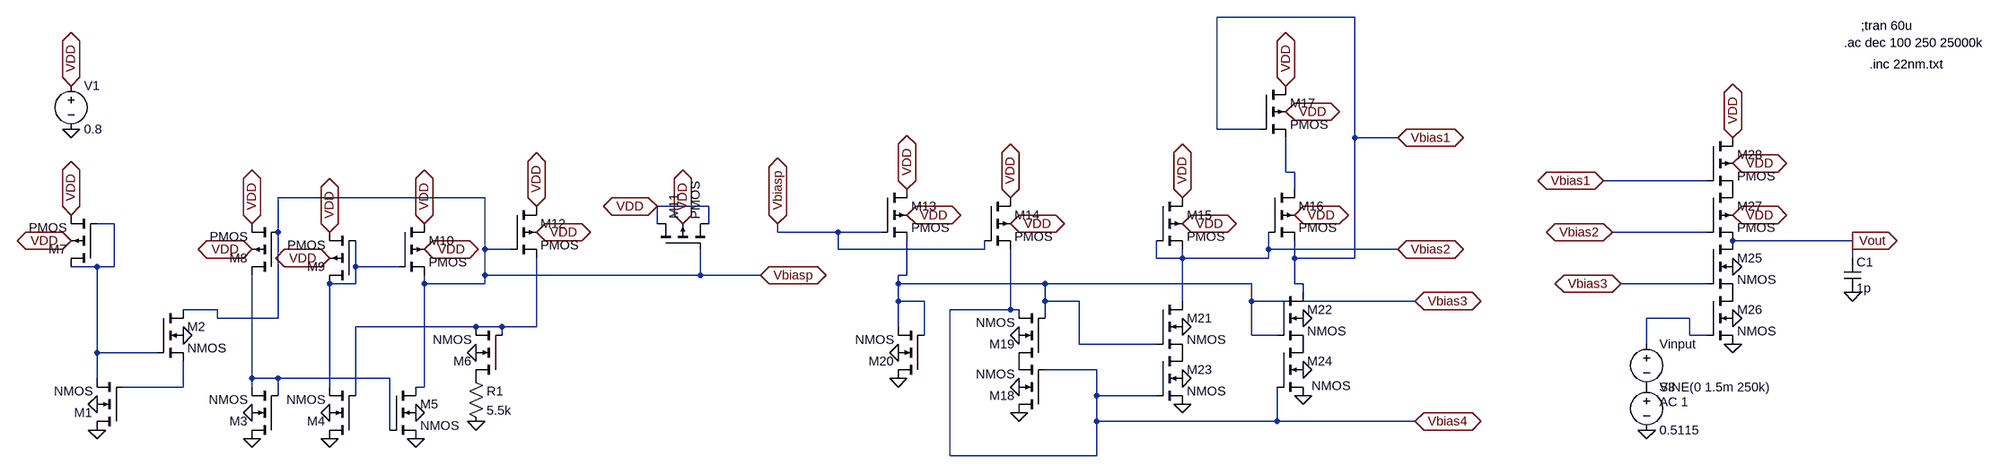
[diagram p0: schematic ckt_with_22nm.asc]
ckt_with_22nm.asc, the LTspice schematic file:
Version 4
SHEET 1 3784 680
WIRE 2416 -496 2160 -496
WIRE 2160 -288 2160 -496
WIRE 2240 -288 2160 -288
WIRE 2416 -272 2416 -496
WIRE 2496 -272 2416 -272
WIRE 2288 -208 2288 -272
WIRE 2304 -208 2288 -208
WIRE 3200 -192 3008 -192
WIRE 2304 -176 2304 -208
WIRE 784 -160 400 -160
WIRE 1200 -144 1104 -144
WIRE 96 -112 64 -112
WIRE 1104 -112 1104 -144
WIRE 1200 -112 1200 -144
WIRE 400 -96 400 -160
WIRE 1328 -96 1328 -112
WIRE 1440 -96 1328 -96
WIRE 1520 -96 1440 -96
WIRE 3200 -96 3024 -96
WIRE 3520 -80 3248 -80
WIRE 784 -64 784 -160
WIRE 832 -64 784 -64
WIRE 1440 -64 1440 -96
WIRE 1712 -64 1712 -80
WIRE 1712 -64 1440 -64
WIRE 2256 -64 2256 -96
WIRE 2496 -64 2256 -64
WIRE 2048 -48 2048 -80
WIRE 2096 -48 2096 -64
WIRE 2096 -48 2048 -48
WIRE 2256 -48 2256 -64
WIRE 2256 -48 2096 -48
WIRE 2304 -48 2304 -80
WIRE 2416 -48 2416 -272
WIRE 2416 -48 2304 -48
WIRE 3520 -48 3520 -80
WIRE 64 -32 16 -32
WIRE 96 -32 96 -112
WIRE 96 -32 64 -32
WIRE 544 -32 544 -80
WIRE 624 -32 544 -32
WIRE 784 -16 784 -64
WIRE 1184 -16 1184 -64
WIRE 1184 -16 784 -16
WIRE 1296 -16 1184 -16
WIRE 1568 -16 1568 -80
WIRE 1568 -16 1552 -16
WIRE 544 0 544 -32
WIRE 544 0 496 0
WIRE 672 0 672 -16
WIRE 784 0 784 -16
WIRE 784 0 672 0
WIRE 1552 0 1552 -16
WIRE 1824 0 1552 0
WIRE 2224 0 1824 0
WIRE 2304 0 2304 -48
WIRE 2320 0 2304 0
WIRE 3200 0 3040 0
WIRE 2320 16 2320 0
WIRE 1552 32 1552 0
WIRE 1600 32 1552 32
WIRE 1824 32 1824 0
WIRE 1888 32 1824 32
WIRE 2096 32 2096 -48
WIRE 2224 32 2224 0
WIRE 2528 32 2224 32
WIRE 288 48 224 48
WIRE 1760 48 1760 -64
WIRE 1760 48 1648 48
WIRE 1776 48 1760 48
WIRE 288 64 288 48
WIRE 400 64 400 -96
WIRE 400 64 288 64
WIRE 1824 64 1824 32
WIRE 3168 64 3088 64
WIRE 768 80 544 80
WIRE 816 80 768 80
WIRE 880 80 880 -48
WIRE 880 80 816 80
WIRE 1552 80 1552 32
WIRE 816 96 816 80
WIRE 1600 96 1600 32
WIRE 2224 96 2224 32
WIRE 2272 96 2224 96
WIRE 3168 96 3168 64
WIRE 3200 96 3168 96
WIRE 1888 112 1888 32
WIRE 2048 112 1888 112
WIRE 3088 112 3088 64
WIRE 64 128 64 -32
WIRE 176 128 64 128
WIRE 1920 160 1824 160
WIRE 64 176 64 128
WIRE 352 176 352 -16
WIRE 400 176 352 176
WIRE 608 176 400 176
WIRE 224 192 224 144
WIRE 224 192 112 192
WIRE 352 192 352 176
WIRE 496 192 496 0
WIRE 672 192 672 0
WIRE 672 192 656 192
WIRE 400 208 400 176
WIRE 544 208 544 80
WIRE 1920 208 1920 160
WIRE 2048 208 1920 208
WIRE 1920 256 1920 208
WIRE 2272 256 2272 192
WIRE 2272 256 1920 256
WIRE 2528 256 2272 256
WIRE 608 272 608 176
WIRE 1648 320 1648 48
WIRE 1920 320 1920 256
WIRE 1920 320 1648 320
FLAG 768 256 0
FLAG 656 288 0
FLAG 496 288 0
FLAG 64 272 0
FLAG 352 288 0
FLAG 352 240 0
FLAG 496 240 0
FLAG 656 240 0
FLAG 768 128 0
FLAG 64 224 0
FLAG 224 96 0
FLAG 1296 -16 Vbiasp
IOPIN 1296 -16 BiDir
FLAG 16 -288 0
FLAG 1328 -112 Vbiasp
IOPIN 1328 -112 BiDir
FLAG 2320 208 0
FLAG 2320 160 0
FLAG 2320 64 0
FLAG 2096 80 0
FLAG 2096 176 0
FLAG 2096 224 0
FLAG 1776 240 0
FLAG 1776 192 0
FLAG 1552 128 0
FLAG 1776 96 0
FLAG 2496 -272 Vbias1
IOPIN 2496 -272 BiDir
FLAG 2496 -64 Vbias2
IOPIN 2496 -64 BiDir
FLAG 2528 32 Vbias3
IOPIN 2528 32 BiDir
FLAG 2528 256 Vbias4
IOPIN 2528 256 BiDir
FLAG 3248 64 0
FLAG 3248 -32 0
FLAG 3248 112 0
FLAG 3520 16 0
FLAG 3088 272 0
FLAG 3008 -192 Vbias1
IOPIN 3008 -192 BiDir
FLAG 3024 -96 Vbias2
IOPIN 3024 -96 BiDir
FLAG 3040 0 Vbias3
IOPIN 3040 0 BiDir
FLAG 16 -368 VDD
IOPIN 16 -368 BiDir
FLAG 16 -128 VDD
IOPIN 16 -128 BiDir
FLAG 16 -80 VDD
IOPIN 16 -80 BiDir
FLAG 352 -112 VDD
IOPIN 352 -112 BiDir
FLAG 352 -64 VDD
IOPIN 352 -64 BiDir
FLAG 496 -96 VDD
IOPIN 496 -96 BiDir
FLAG 496 -48 VDD
IOPIN 496 -48 BiDir
FLAG 672 -112 VDD
IOPIN 672 -112 BiDir
FLAG 672 -64 VDD
IOPIN 672 -64 BiDir
FLAG 880 -96 VDD
IOPIN 880 -96 BiDir
FLAG 880 -144 VDD
IOPIN 880 -144 BiDir
FLAG 1152 -112 VDD
IOPIN 1152 -112 BiDir
FLAG 1104 -144 VDD
IOPIN 1104 -144 BiDir
FLAG 1568 -128 VDD
IOPIN 1568 -128 BiDir
FLAG 1568 -176 VDD
IOPIN 1568 -176 BiDir
FLAG 1760 -160 VDD
IOPIN 1760 -160 BiDir
FLAG 1760 -112 VDD
IOPIN 1760 -112 BiDir
FLAG 2096 -112 VDD
IOPIN 2096 -112 BiDir
FLAG 2096 -160 VDD
IOPIN 2096 -160 BiDir
FLAG 2288 -368 VDD
IOPIN 2288 -368 BiDir
FLAG 2288 -320 VDD
IOPIN 2288 -320 BiDir
FLAG 2304 -128 VDD
IOPIN 2304 -128 BiDir
FLAG 3248 -224 VDD
IOPIN 3248 -224 BiDir
FLAG 3248 -272 VDD
IOPIN 3248 -272 BiDir
FLAG 3248 -128 VDD
IOPIN 3248 -128 BiDir
FLAG 1552 176 0
FLAG 3520 -80 Vout
IOPIN 3520 -80 Out
SYMBOL nmos4 112 272 R180
SYMATTR InstName M1
SYMATTR Value2 l=0.044u w=0.22u
SYMBOL nmos4 176 48 R0
SYMATTR InstName M2
SYMATTR Value2 l=44n w=88n
SYMBOL nmos4 400 288 R180
SYMATTR InstName M3
SYMATTR Value2 l=44n w=220n
SYMBOL nmos4 544 288 R180
SYMATTR InstName M4
SYMATTR Value2 l=44n w=220n
SYMBOL nmos4 608 192 R0
SYMATTR InstName M5
SYMATTR Value2 l=44n w=220n
SYMBOL nmos4 816 176 R180
SYMATTR InstName M6
SYMATTR Value2 l=44n w=660n
SYMBOL pmos4 64 -32 R180
SYMATTR InstName M7
SYMATTR Value2 l=0.44u w=0.22u
SYMBOL pmos4 400 -16 R180
SYMATTR InstName M8
SYMATTR Value2 l=44n w=5208n
SYMBOL pmos4 544 0 R180
SYMATTR InstName M9
SYMATTR Value2 l=44n w=528n
SYMBOL pmos4 624 -112 R0
SYMATTR InstName M10
SYMATTR Value2 l=44n w=528n
SYMBOL pmos4 1104 -64 R270
SYMATTR InstName M11
SYMATTR Value2 l=1.1u w=1.1u
SYMBOL pmos4 832 -144 R0
SYMATTR InstName M12
SYMATTR Value2 l=44n w=528n
SYMBOL res 752 160 R0
SYMATTR InstName R1
SYMATTR Value 5.5k
SYMBOL voltage 16 -384 R0
WINDOW 123 0 0 Left 0
WINDOW 39 0 0 Left 0
SYMATTR InstName V1
SYMATTR Value 0.8
SYMBOL pmos4 1520 -176 R0
SYMATTR InstName M13
SYMATTR Value2 l=44n w=528n
SYMBOL pmos4 1712 -160 R0
SYMATTR InstName M14
SYMATTR Value2 l=44n w=528n
SYMBOL pmos4 2048 -160 R0
SYMATTR InstName M15
SYMATTR Value2 l=902n w=8580n
SYMBOL pmos4 2256 -176 R0
SYMATTR InstName M16
SYMATTR Value2 l=370n w=4440n
SYMBOL pmos4 2240 -368 R0
SYMATTR InstName M17
SYMATTR Value2 l=22n w=2860n
SYMBOL nmos4 1824 240 R180
SYMATTR InstName M18
SYMATTR Value2 l=44n w=220n
SYMBOL nmos4 1824 144 R180
SYMATTR InstName M19
SYMATTR Value2 l=44n w=220n
SYMBOL nmos4 2048 32 R0
SYMATTR InstName M21
SYMATTR Value2 l=44n w=220n
SYMBOL nmos4 2272 16 R0
SYMATTR InstName M22
SYMATTR Value2 l=440n w=2200n
SYMBOL nmos4 2048 128 R0
SYMATTR InstName M23
SYMATTR Value2 l=44n w=220n
SYMBOL nmos4 2272 112 R0
WINDOW 3 64 78 Left 2
SYMATTR InstName M24
SYMATTR Value2 l=44n w=220n
SYMBOL nmos4 1600 176 R180
SYMATTR InstName M20
SYMATTR Value2 l=44n w=132n
SYMBOL nmos4 3200 -80 R0
SYMATTR InstName M25
SYMATTR Value2 l=44n w=264n
SYMBOL nmos4 3200 16 R0
SYMATTR InstName M26
SYMATTR Value2 l=44n w=264n
SYMBOL pmos4 3200 -176 R0
SYMATTR InstName M27
SYMATTR Value2 l=44n w=1056n
SYMBOL pmos4 3200 -272 R0
SYMATTR InstName M28
SYMATTR Value2 l=44n w=1056n
SYMBOL cap 3504 -48 R0
SYMATTR InstName C1
SYMATTR Value 1p
SYMBOL voltage 3088 96 R0
WINDOW 123 24 124 Left 2
WINDOW 39 0 0 Left 0
SYMATTR Value2 AC 1
SYMATTR InstName Vinput
SYMATTR Value SINE(0 1.5m 250k)
SYMBOL voltage 3088 176 R0
WINDOW 123 24 124 Left 2
WINDOW 39 0 0 Left 0
SYMATTR InstName V3
SYMATTR Value 0.5115
TEXT 3536 -480 Left 2 !;tran 60u
TEXT 3504 -448 Left 2 !.ac dec 100 250 25000k
TEXT 3552 -408 Left 2 !.inc 22nm.txt

The netlist it stands for:
* ckt_with_22nm.asc
M1 0 N007 N002 0 NMOS l=0.044u w=0.22u
M2 Vbiasp N002 N007 0 NMOS l=44n w=88n
M3 0 N006 N006 0 NMOS l=44n w=220n
M4 0 N005 N003 0 NMOS l=44n w=220n
M5 Vbiasp N006 0 0 NMOS l=44n w=220n
M6 P001 N005 N005 0 NMOS l=44n w=660n
M7 N002 N002 VDD VDD PMOS l=0.44u w=0.22u
M8 N006 Vbiasp VDD VDD PMOS l=44n w=5208n
M9 N003 N003 VDD VDD PMOS l=44n w=528n
M10 VDD N003 Vbiasp VDD PMOS l=44n w=528n
M11 VDD Vbiasp VDD VDD PMOS l=1.1u w=1.1u
M12 VDD Vbiasp N005 VDD PMOS l=44n w=528n
R1 P001 0 5.5k
V1 VDD 0 0.8
M13 VDD Vbiasp Vbias3 VDD PMOS l=44n w=528n
M14 VDD Vbiasp Vbias4 VDD PMOS l=44n w=528n
M15 VDD Vbias2 Vbias2 VDD PMOS l=902n w=8580n
M16 N001 Vbias2 Vbias1 VDD PMOS l=370n w=4440n
M17 VDD Vbias1 N001 VDD PMOS l=22n w=2860n
M18 0 Vbias4 P002 0 NMOS l=44n w=220n
M19 P002 Vbias3 Vbias4 0 NMOS l=44n w=220n
M21 Vbias2 Vbias3 P003 0 NMOS l=44n w=220n
M22 Vbias1 Vbias3 P004 0 NMOS l=440n w=2200n
M23 P003 Vbias4 0 0 NMOS l=44n w=220n
M24 P004 Vbias4 0 0 NMOS l=44n w=220n
M20 0 Vbias3 Vbias3 0 NMOS l=44n w=132n
M25 Vout Vbias3 P005 0 NMOS l=44n w=264n
M26 P005 N004 0 0 NMOS l=44n w=264n
M27 P006 Vbias2 Vout VDD PMOS l=44n w=1056n
M28 VDD Vbias1 P006 VDD PMOS l=44n w=1056n
C1 Vout 0 1p
Vinput N004 P007 SINE(0 1.5m 250k) AC 1
V3 P007 0 0.5115
.model NMOS NMOS
.model PMOS PMOS
.lib standard.mos
;tran 60u
.ac dec 100 250 25000k
.inc 22nm.txt
.backanno
.end